# Altium schematic sheet Sheet1.SchDoc
size A4
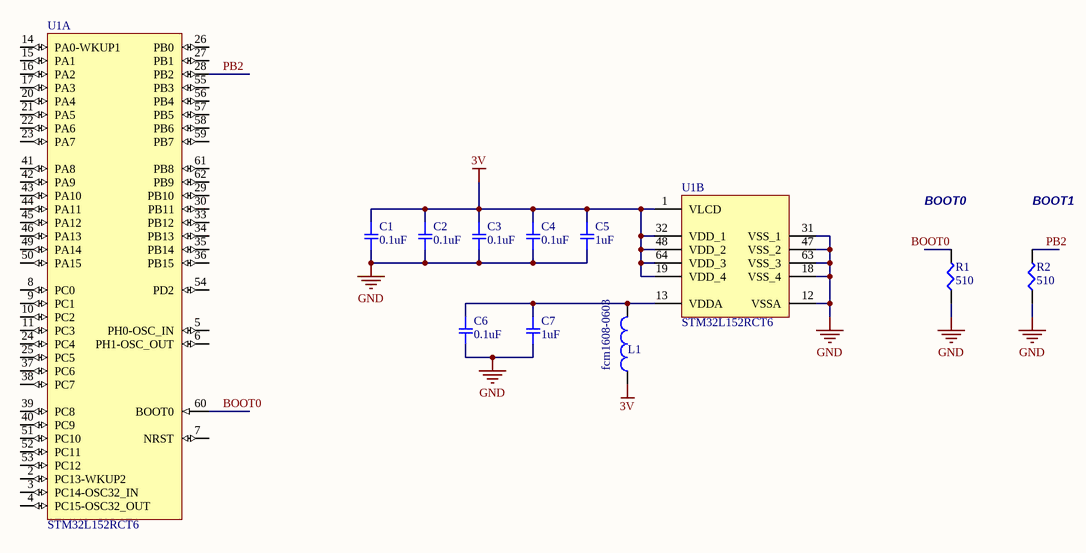
[diagram p0: Sheet1.SchDoc]

## Parts
C1  0.1uF  [SMD-0805C]
C2  0.1uF  [SMD-0805C]
C3  0.1uF  [SMD-0805C]
C4  0.1uF  [SMD-0805C]
C5  1uF  [SMD-0805C]
C6  0.1uF  [SMD-0805C]
C7  1uF  [SMD-0805C]
L1  fcm1608-0603  [0603]
R1  510  [SMD-0805-RES]
R2  510  [SMD-0805-RES]
U1  STM32L152RCT6  [STM-LQFP64_L]  (parts A,B of 2)

## Nets
3V: C1.1 C2.1 C3.1 C4.1 C5.1 L1.1 U1.1(VLCD) U1.19(VDD_4) U1.32(VDD_1) U1.48(VDD_2) U1.64(VDD_3)
GND: C1.2 C2.2 C3.2 C4.2 C5.2 C6.2 C7.2 R1.1 R2.1 U1.12(VSSA) U1.18(VSS_4) U1.31(VSS_1) U1.47(VSS_2) U1.63(VSS_3)
BOOT0: U1.60(BOOT0)
PB2: R2.2 U1.28(PB2)
NetC6_1: C6.1 C7.1 L1.2 U1.13(VDDA)

Not connected (* = marked no-connect by the designer): R1 2; U1 2(PC13-WKUP2) 3(PC14-OSC32_IN) 4(PC15-OSC32_OUT) 5(PH0-OSC_IN) 6(PH1-OSC_OUT) 7(NRST) 8(PC0) 9(PC1) 10(PC2) 11(PC3) 14(PA0-WKUP1) 15(PA1) 16(PA2) 17(PA3) 20(PA4) 21(PA5) 22(PA6) 23(PA7) 24(PC4) 25(PC5) 26(PB0) 27(PB1) 29(PB10) 30(PB11) 33(PB12) 34(PB13) 35(PB14) 36(PB15) 37(PC6) 38(PC7) 39(PC8) 40(PC9) 41(PA8) 42(PA9) 43(PA10) 44(PA11) 45(PA12) 46(PA13) 49(PA14) 50(PA15) 51(PC10) 52(PC11) 53(PC12) 54(PD2) 55(PB3) 56(PB4) 57(PB5) 58(PB6) 59(PB7) 61(PB8) 62(PB9)

## Notes on the sheet
- BOOT0
- BOOT1
- Labels drawn without touching a wire or pin: BOOT0

## Library data of the parts
C1-C4 C6 = CL21B104JBCNNNC: CAP CER 0.1uF 50V X7T 0805; Part Number: GC321AD72E103KX01D; Manufacturer: Samsung Electro-Mechanics; Tolerance: 5%; Package / Case: 0805; Voltage: 50V; VALUE: 0.1uF
C5 C7 = CL21B105KOFNNNG: CAP CER 1uF 16V X7T 0805; Manufacturer: Samsung Electro-Mechanics; Tolerance: 10%; Part Number: CL21B105KOFNNNG; Package / Case: 0805; Voltage: 16V; VALUE: 1uF
L1 = Inductor: Value: 100uH; Published: 8-Jun-2000; Revision: July-2002: Re-released for DXP Platform.; Publisher: Altium Limited
R1 R2 = ERJ-6GEYJ511V: RES SMD 510 OHM 5% 1/8W 0805; Manufacturer: Panasonic Electronic Components; Factory Stock: 0; Unit Price (USD): 0.00496; @ qty: 1500; Minimum Quantity: 1; Power (Watts): 0.125W, 1/8W; Temperature Coefficient: ±200ppm/°C; Part Number: ERJ-6GEYJ511V; Datasheets: http://industrial.panasonic.com/www-cgi/jvcr13pz.cgi?E+PZ+3+AOA0001+ERJ6GEYJ511V+7+WW; Image: //media.digikey.com/Renders/Panasonic%20Renders/ERJ-0805%20Pkg.jpg; Digi-Key Part Number: P510ACT-ND; Quantity Available: 116915; Packaging: Cut Tape (CT); Series: ERJ; Part Status: Active; Value: 510; Tolerance: ±5%; Composition: Thick Film; Features: Automotive AEC-Q200; Operating Temperature: -55°C ~ 155°C; Package / Case: 0805 (2012 Metric); Supplier Device Package: 0805; Size / Dimension: 0.079" L x 0.049" W (2.00mm x 1.25mm); Height - Seated (Max): 0.028" (0.70mm); Number of Terminations: 2; Failure Rate: -
U1 = STM32L152RCT6: ARM Cortex-M3 32-bit MCU, 256 KB Flash, 32 KB Internal RAM, 51 I/Os, 64-pin LQFP, -40 to 85 degC, Tray; Manufacturer: STMicroelectronics; D/A Converter: 2x12-bit (2 Channel); Data E2PROM nom (B): 8192; Display controller: LCD 4x32/8x28; FLASH Size (Prog) (kB): 256; I/Os (High Current): 51; Internal RAM Size (kB): 32; Supply Voltage(Vcc) min (V): 1.65; DatasheetVersion: Rev. 3; PackageVersion: Rev. 4, 06/2013; PackageReference: LQFP64; PackageDescription: 64-Pin Low Profile Quad Flat Package, 10 x 10 mm Body, 0.5 mm Pitch; Core: ARM Cortex-M3; Operating Frequency(F) (Processor speed) (MHz): 32; Packing: Tray; Mounting Technology: Surface Mount; PartNumber: STM32L152RCT6; ComponentLink1Description: Manufacturer URL; ComponentLink1URL: http://www.st.com/web/en/home.html; ComponentLink2Description: Datasheet; ComponentLink2URL: http://www.st.com/st-web-ui/static/active/en/resource/technical/document/datasheet/DM00048356.pdf; ComponentLink3Description: Package Specification; ComponentLink3URL: http://www.st.com/st-web-ui/static/active/en/resource/technical/document/datasheet/DM00037051.pdf